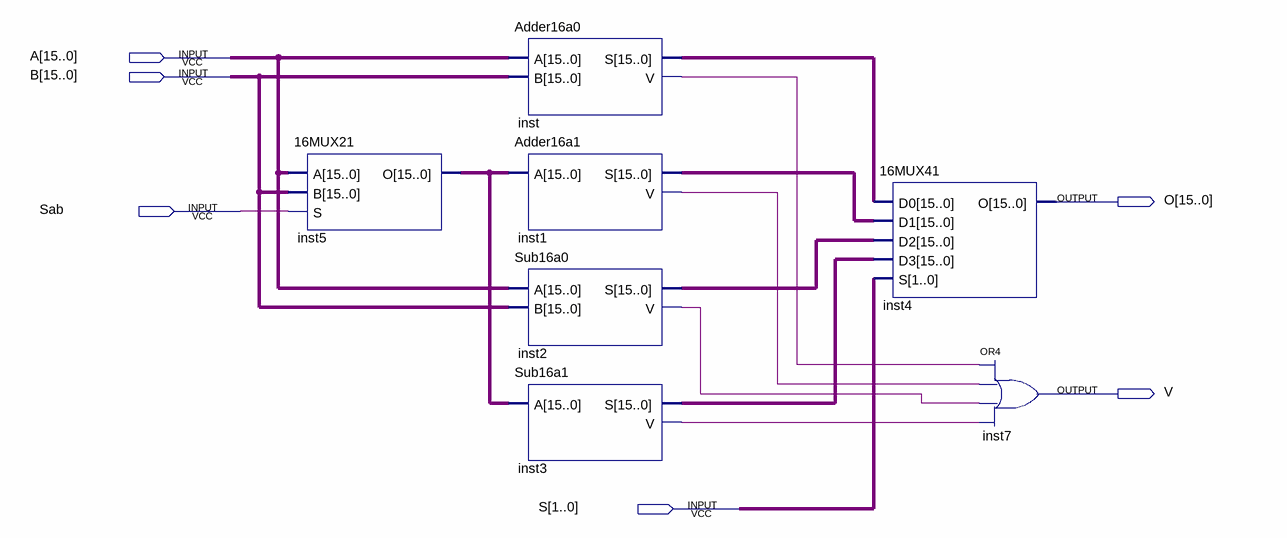
[diagram p0: schematic sheet]
// Quartus schematic AU.bdf as structural Verilog: 7 symbols, 6 pins
module AU (
  input  [15:0] A,
  input  [15:0] B,
  input  Sab,
  input  [1:0] S,
  output [15:0] O,
  output V
);

  wire inst1_v, inst2_v, inst3_v, inst_v;
  wire [15:0] inst1_s, inst2_s, inst3_s, inst5_o, inst_s;

  \16MUX21  inst5 (.A(A), .B(B), .S(Sab), .O(inst5_o));
  Adder16a0 inst (.A(A), .B(B), .S(inst_s), .V(inst_v));
  Adder16a1 inst1 (.A(inst5_o), .S(inst1_s), .V(inst1_v));
  Sub16a0 inst2 (.A(A), .B(B), .S(inst2_s), .V(inst2_v));
  Sub16a1 inst3 (.A(inst5_o), .S(inst3_s), .V(inst3_v));
  \16MUX41  inst4 (.D0(inst_s), .D1(inst1_s), .D2(inst2_s), .D3(inst3_s), .S(S), .O(O));
  or inst7 (V, inst_v, inst1_v, inst2_v, inst3_v);
endmodule
